# Altium schematic sheet 10-Buffer.SchDoc
size A4; DocumentNumber: 10; SheetNumber: 10; SheetTotal: 26
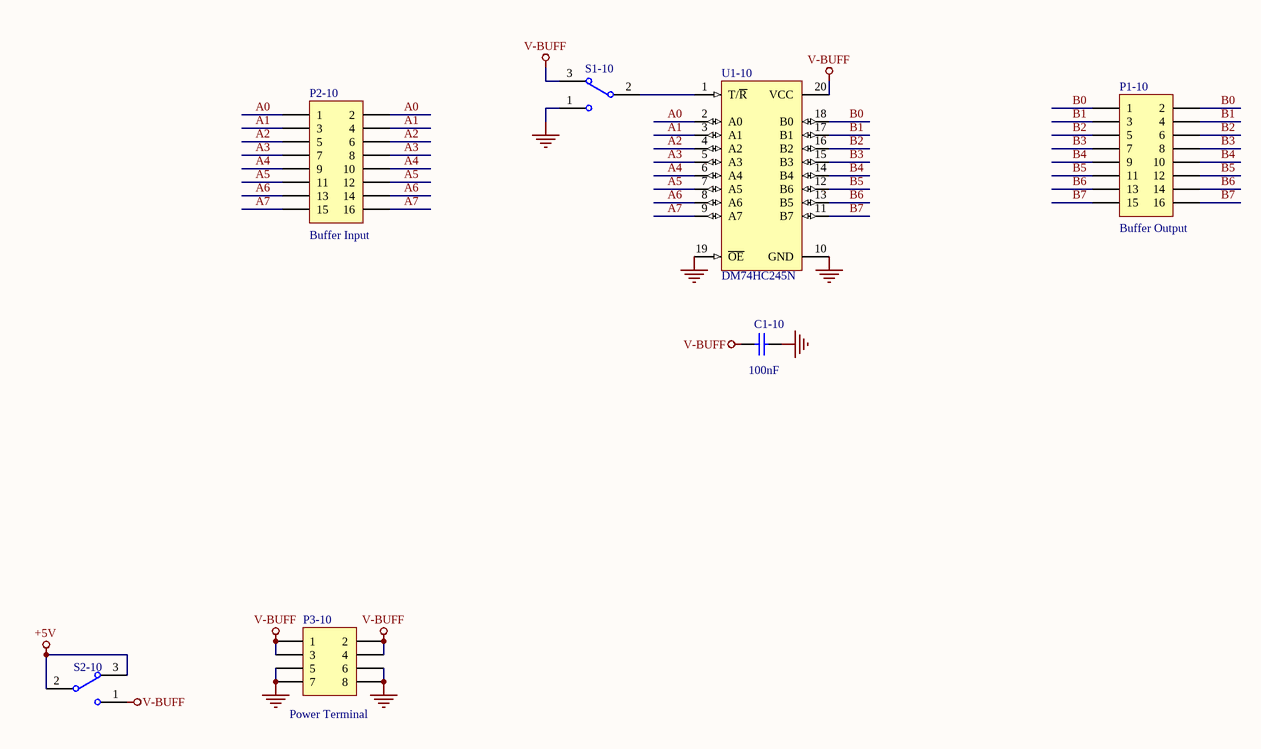
[diagram p0: 10-Buffer.SchDoc]

## Parts
C1-10  value 100nF  [c-0805]  (hidden comment: 104)
P1-10  value Buffer Output  [JP2.54-F-2x08A]  (hidden comment: Header 8X2)
P2-10  value Buffer Input  [JP2.54-F-2x08A]  (hidden comment: Header 8X2)
P3-10  Publisher: Power Terminal  [JP2.54-F-2x04A]  (hidden comment: Header 4X2)
S1-10  SW-SPDT  [SW-SLIDE-2P-2W]  (value not drawn)
S2-10  SW-SPDT  [SW-SLIDE-2P-2W]  (value not drawn)
U1-10  DM74HC245N  [SK-DIP20-300]

## Nets
+5V: S2-10.2 S2-10.3
GND: C1-10.2 P3-10.5 P3-10.6 P3-10.7 P3-10.8 S1-10.1 U1-10.10(GND) U1-10.19(~{OE})
V-BUFF: C1-10.1 P3-10.1 P3-10.2 P3-10.3 P3-10.4 S1-10.3 S2-10.1 U1-10.20(VCC)
A0: P2-10.1 P2-10.2 U1-10.2(A0)
A1: P2-10.3 P2-10.4 U1-10.3(A1)
A2: P2-10.5 P2-10.6 U1-10.4(A2)
A3: P2-10.7 P2-10.8 U1-10.5(A3)
A4: P2-10.9 P2-10.10 U1-10.6(A4)
A5: P2-10.11 P2-10.12 U1-10.7(A5)
A6: P2-10.13 P2-10.14 U1-10.8(A6)
A7: P2-10.15 P2-10.16 U1-10.9(A7)
B0: P1-10.1 P1-10.2 U1-10.18(B0)
B1: P1-10.3 P1-10.4 U1-10.17(B1)
B2: P1-10.5 P1-10.6 U1-10.16(B2)
B3: P1-10.7 P1-10.8 U1-10.15(B3)
B4: P1-10.9 P1-10.10 U1-10.14(B4)
B5: P1-10.11 P1-10.12 U1-10.12(B6)
B6: P1-10.13 P1-10.14 U1-10.13(B5)
B7: P1-10.15 P1-10.16 U1-10.11(B7)
NetS1-10_2: S1-10.2 U1-10.1(T/~{R})

## Library data of the parts
C1-10 = Cap: Capacitor; Published: 8-Jun-2000; LatestRevisionDate: 17-Jul-2002; LatestRevisionNote: Re-released for DXP Platform.; PackageReference: RAD-0.3; Publisher: Altium Limited; PackageDescription: Radial Cap, Thru-Hole; 2 Leads; 0.3 in Pin Spacing
P1-10 P2-10 = Header 8X2: Header, 8-Pin, Dual row; LatestRevisionDate: 17-Jul-2002; LatestRevisionNote: Re-released for DXP Platform.
P3-10 = Header 4X2: Header, 4-Pin, Dual row; LatestRevisionDate: 17-Jul-2002; LatestRevisionNote: Re-released for DXP Platform.
S1-10 S2-10 = SW-SPDT: SPDT Subminiature Toggle Switch, Right Angle Mounting, Vertical Actuation; Published: 24-Mar-1999; LatestRevisionDate: 17-Dec-2003; LatestRevisionNote: Schematic revised, PCB Footprint replaced.; DatasheetVersion: 05-Dec-2000; PackageReference: TL36WW15050; Publisher: Altium Limited; PackageDescription: Switch; 4 Leads; ComponentLink1Description: Manufacturer Link; ComponentLink1URL: http://www.apem.com
U1-10 = DM74LS245N: 3-State Octal Bus Transceiver; Published: 17-Jul-2002; LatestRevisionDate: 04-Mar-2005; LatestRevisionNote: Stylized 3D Model Added.; DatasheetVersion: Mar-1998; PackageVersion: 2000; PackageReference: N20A; Publisher: Altium Limited; PackageDescription: DIP, 20-Pin, Row Spacing 7.62 mm, Pitch 2.54 mm; Code_JEDEC: MS-001-AD; ComponentLink1Description: Manufacturer Link; ComponentLink1URL: http://www.fairchildsemi.com/